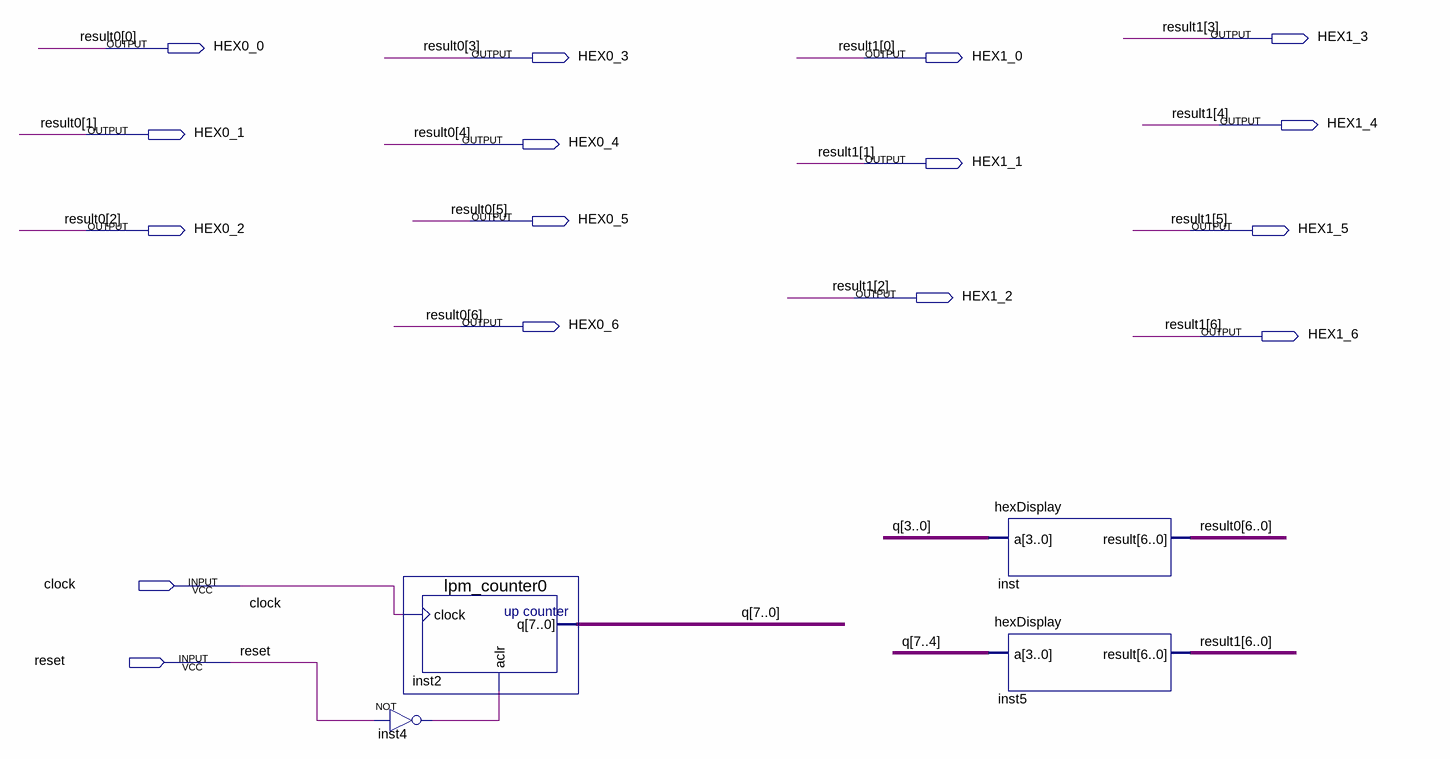
[diagram p0: schematic sheet]
// Quartus schematic displayTest.bdf as structural Verilog: 4 symbols, 16 pins
module displayTest (
  input  clock,
  input  reset,
  output HEX1_3,
  output HEX0_0,
  output HEX0_3,
  output HEX1_0,
  output HEX1_4,
  output HEX0_1,
  output HEX0_4,
  output HEX1_1,
  output HEX0_5,
  output HEX0_2,
  output HEX1_5,
  output HEX1_2,
  output HEX0_6,
  output HEX1_6
);

  wire inst4_out;
  wire [7:0] q;

  lpm_counter0 inst2 (.clock(clock), .aclr(inst4_out), .q(q));
  not inst4 (inst4_out, reset);
  hexDisplay inst (.a(q[3:0]), .result({HEX0_6, HEX0_5, HEX0_4, HEX0_3, HEX0_2, HEX0_1, HEX0_0}));
  hexDisplay inst5 (.a(q[7:4]), .result({HEX1_6, HEX1_5, HEX1_4, HEX1_3, HEX1_2, HEX1_1, HEX1_0}));

  // Other names for the same wires on the sheet: result0[6:0] = {HEX0_6, HEX0_5, HEX0_4, HEX0_3, HEX0_2, HEX0_1, HEX0_0};
  //   result1[6:0] = {HEX1_6, HEX1_5, HEX1_4, HEX1_3, HEX1_2, HEX1_1, HEX1_0}
endmodule
